# Altium schematic sheet Sheet_1_2021-01-20.schdoc
size 51 x 37 mm
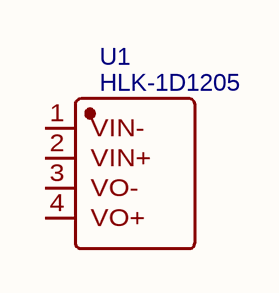
[diagram p0: Sheet_1_2021-01-20.schdoc]

## Parts
U1  HLK-1D1205  [PWRM-TH_HLK-1DXXXX]

## Nets

Not connected (* = marked no-connect by the designer): U1 1(VIN-) 2(VIN+) 3(VO-) 4(VO+)

## Library data of the parts
U1 = HLK-1D1205: BOM_Manufacturer: HI-LINK; Contributor: LCSC; SMT Type: Extend; BOM_Supplier: LCSC; BOM_Supplier Part: C474030; BOM_Manufacturer Part: HLK-1D1205; BOM_JLCPCB SMD: Yes; spicePre: U; spiceSymbolName: HLK-1D1205